# Altium schematic sheet PiAndServos.SchDoc (part 3 of 5)
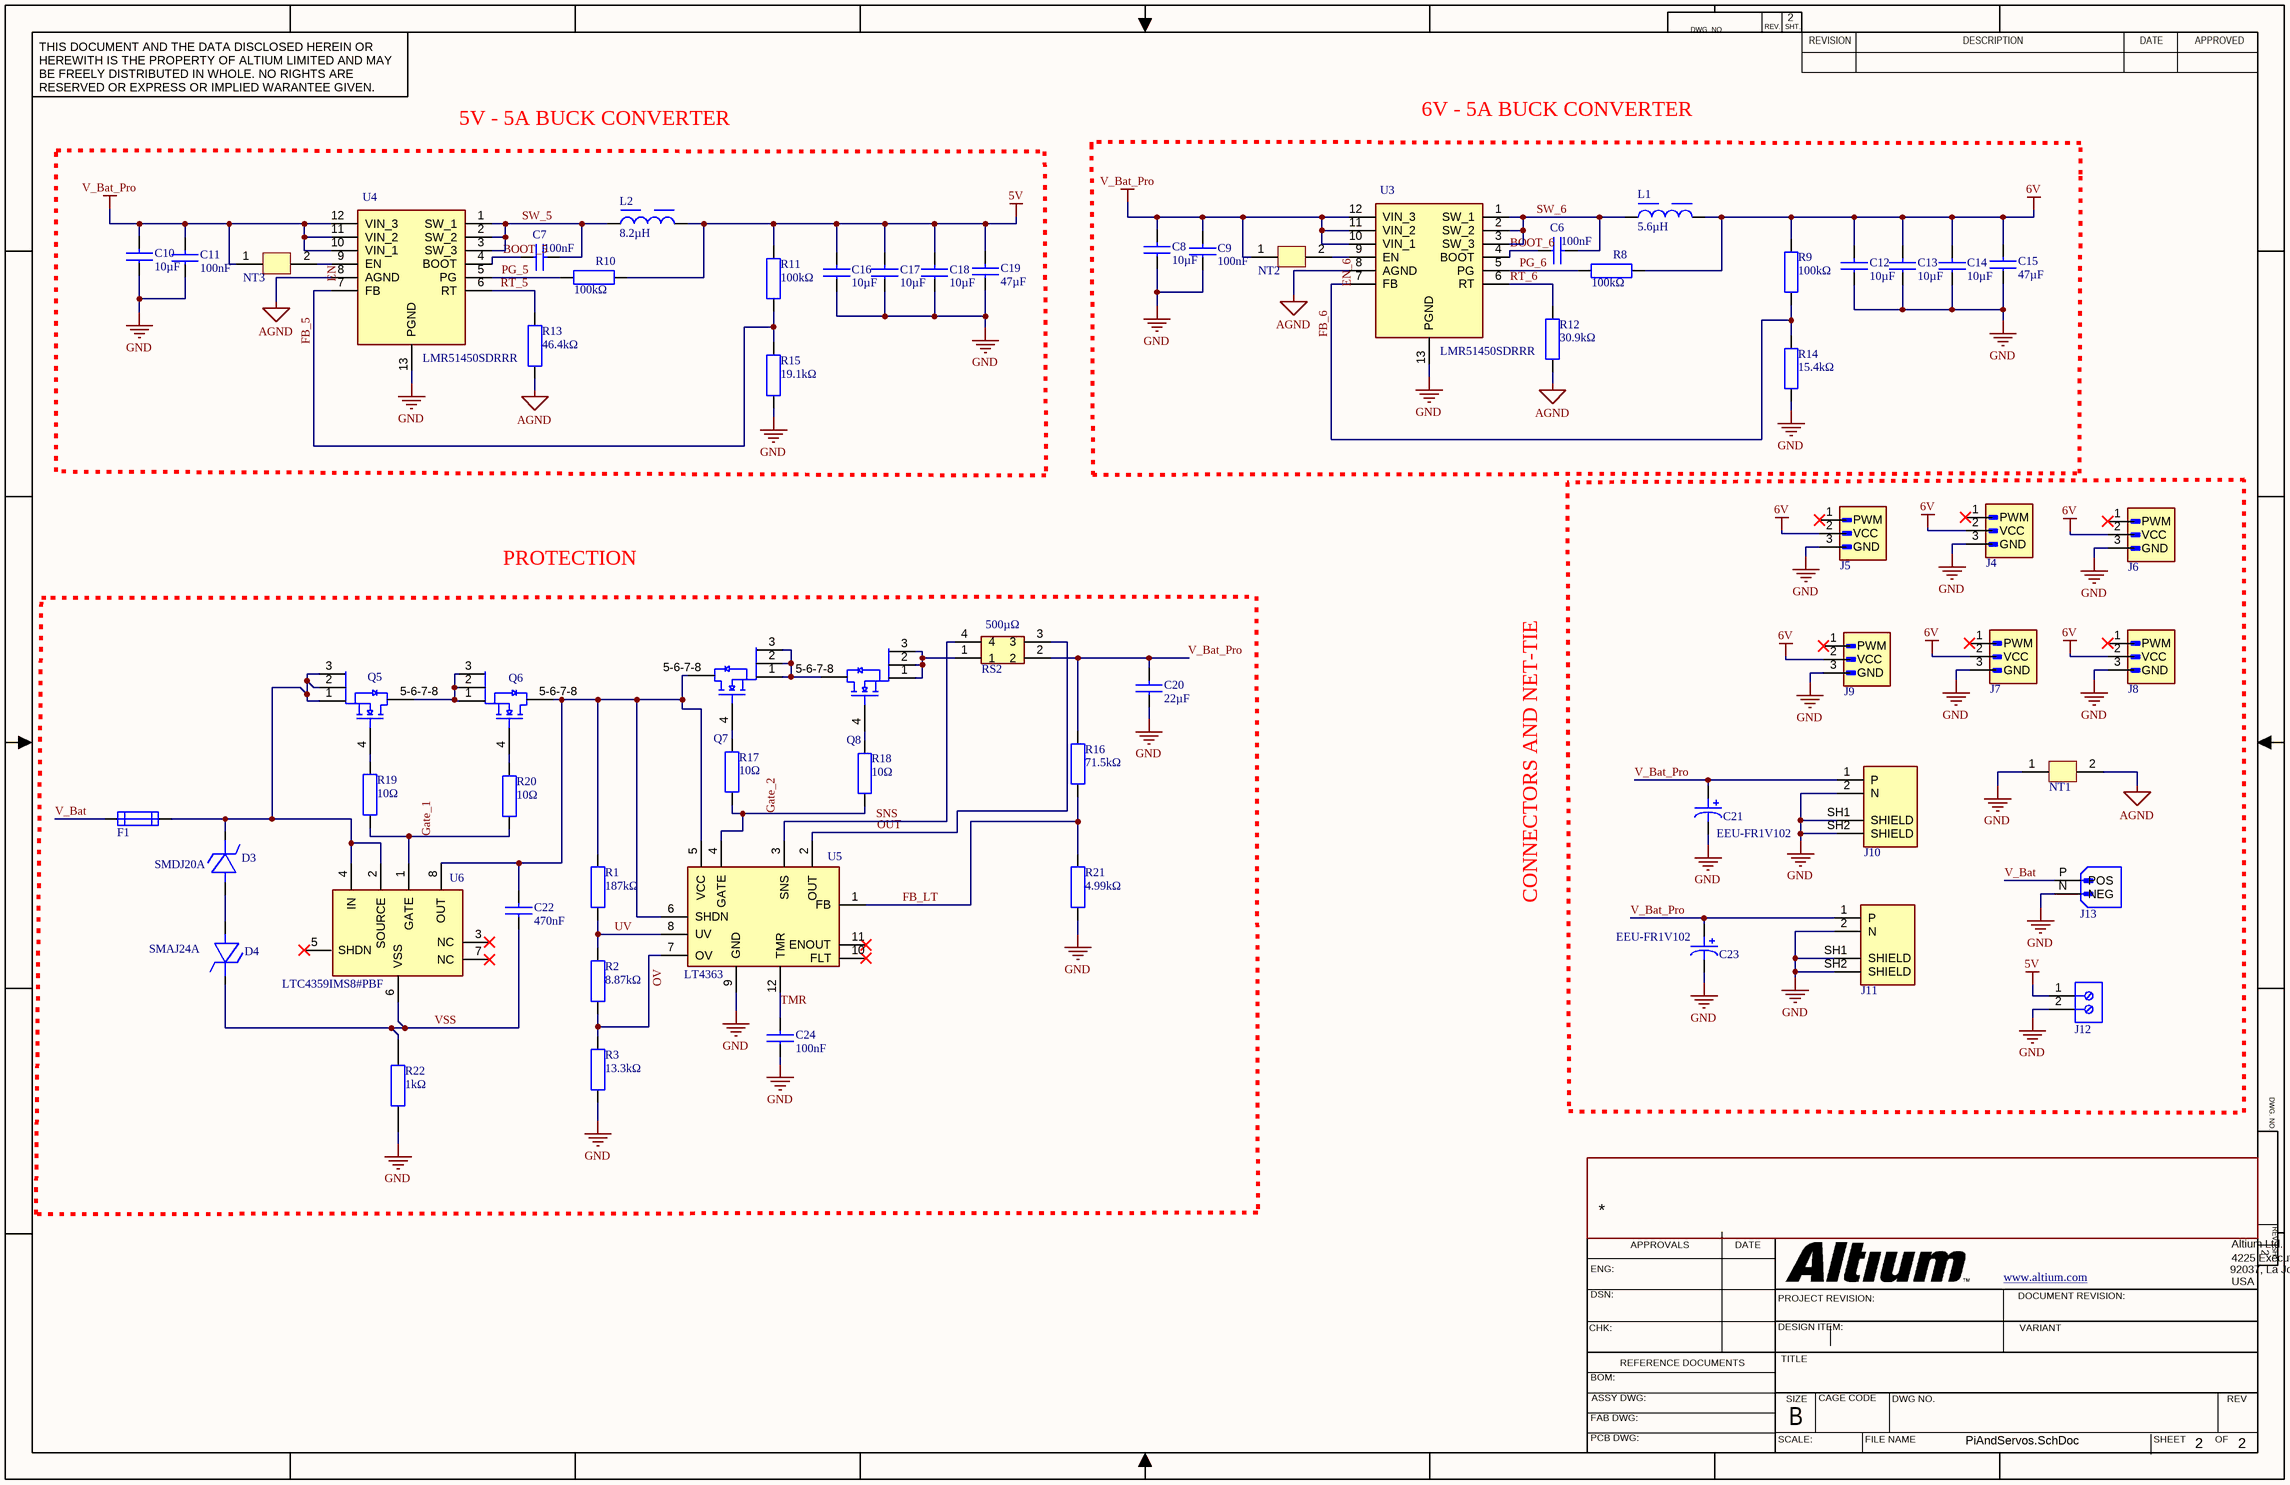
[diagram p2: PiAndServos.SchDoc]

## Library data of the parts (continued)
J12 = 1725656: Block, Terminal; 6 A; 63 V; 2.54 mm; 26 to 20 AWG; 2; Screw; Soldering; 1.5 kV; Manufacturer: Phoenix Contact; Approvals: CSA, UL, VDE, cUL; Connector Type: PCB, Screw, Terminal Block; Current: 6A; Max Supply Voltage: 63V; Number of Circuits: 2; Number of Levels: 1; Pitch: 2.54mm; Stripping Length: 4.5mm; Voltage: 125V; Voltage Rating: 160V; Wire/Cable Gauge: 20AWG; Wire Gauge (Max): 26AWG; Supplier: Arrow Electronics; Supplier Part Number: 1725656; Manufacturer Part Number: 1725656; RoHS: Compliant; Category: Terminal Blocks; Stock: 13040; Pricing: 1=1,249, 251=1,214 (USD); China RoHS: Compliant; Color: Green; Contact Material: Tin; Current Rating: 6A; Depth: 6.2mm; Flammability Rating: UL94 V-0; Height: 6.2mm; Housing Color: Green; Insulation Material: Nylon; Lead Free: Lead Free; Lead Pitch: 2.54mm; Lifecycle Status: Production; Max Current Rating: 6A; Mounting Technology: Screw; Number of Contacts: 2; Pins: 2; Number of Poles: 2; Number of Positions: 2; Number of Positions Per Level: 2; Number of Rows: 1; Radiation Hardening: No; REACH SVHC: Yes; Termination: Solder; Voltage Rating (AC): 63V; Weight: 639.990485mg; Width: 12mm; Wire Gauge (Min): 20AWG; ComponentLink1URL: https://datasheet.octopart.com:443/1725656-Phoenix-Contact-datasheet-141439143.pdf?src-supplier=Upverter; ComponentLink1Description: https://datasheet.octopart.com:443/1725656-Phoenix-Contact-datasheet-141439143.pdf?src-supplier=Upverter; ComponentLink2URL: https://datasheet.octopart.com:443/1725656-Phoenix-Contact-datasheet-101586919.pdf?src-supplier=element14+APAC; ComponentLink2Description: https://datasheet.octopart.com:443/1725656-Phoenix-Contact-datasheet-101586919.pdf?src-supplier=element14+APAC; ComponentLink3URL: https://datasheet.octopart.com:443/1725656-Phoenix-Contact-datasheet-5302866.pdf?src-supplier=element14+APAC; ComponentLink3Description: https://datasheet.octopart.com:443/1725656-Phoenix-Contact-datasheet-5302866.pdf?src-supplier=element14+APAC; ComponentLink4URL: https://datasheet.octopart.com:443/1725656-Phoenix-Contact-datasheet-66629008.pdf?src-supplier=element14+APAC; ComponentLink4Description: https://datasheet.octopart.com:443/1725656-Phoenix-Contact-datasheet-66629008.pdf?src-supplier=element14+APAC; ComponentLink5URL: https://datasheet.octopart.com:443/1725656-Phoenix-Contact-datasheet-170281659.pdf?src-supplier=Master+Electronics; ComponentLink5Description: https://datasheet.octopart.com:443/1725656-Phoenix-Contact-datasheet-170281659.pdf?src-supplier=Master+Electronics; ComponentLink6URL: https://datasheet.octopart.com:443/1725656-Phoenix-Contact-datasheet-154778688.pdf?src-supplier=Electro+Sonic; ComponentLink6Description: https://datasheet.octopart.com:443/1725656-Phoenix-Contact-datasheet-154778688.pdf?src-supplier=Electro+Sonic; ComponentLink7URL: https://datasheet.octopart.com:443/1725656-Phoenix-Contact-datasheet-525036.pdf?src-supplier=Newark; ComponentLink7Description: https://datasheet.octopart.com:443/1725656-Phoenix-Contact-datasheet-525036.pdf?src-supplier=Newark; ComponentLink8URL: https://datasheet.octopart.com:443/1725656-Phoenix-Contact-datasheet-169855803.pdf?src-supplier=Amar+Radio+Corporation; ComponentLink8Description: https://datasheet.octopart.com:443/1725656-Phoenix-Contact-datasheet-169855803.pdf?src-supplier=Amar+Radio+Corporation; ComponentLink9URL: https://datasheet.octopart.com:443/1725656-Phoenix-Contact-datasheet-164874127.pdf?src-supplier=Burklin+Elektronik; ComponentLink9Description: https://datasheet.octopart.com:443/1725656-Phoenix-Contact-datasheet-164874127.pdf?src-supplier=Burklin+Elektronik; ComponentLink10URL: https://datasheet.octopart.com:443/1725656-Phoenix-Contact-datasheet-62053918.pdf?src-supplier=TME; ComponentLink10Description: https://datasheet.octopart.com:443/1725656-Phoenix-Contact-datasheet-62053918.pdf?src-supplier=TME; ComponentLink11URL: https://datasheet.octopart.com:443/1725656-Phoenix-Contact-datasheet-11891466.pdf?src-supplier=Arrow+Electronics; ComponentLink11Description: https://datasheet.octopart.com:443/1725656-Phoenix-Contact-datasheet-11891466.pdf?src-supplier=Arrow+Electronics; ComponentLink12URL: https://datasheet.octopart.com:443/1725656-Phoenix-Contact-datasheet-33456951.pdf?src-supplier=MRO+Stop; ComponentLink12Description: https://datasheet.octopart.com:443/1725656-Phoenix-Contact-datasheet-33456951.pdf?src-supplier=MRO+Stop; ComponentLink13URL: https://datasheet.octopart.com:443/1725656-Phoenix-Contact-datasheet-62122436.pdf?src-supplier=RS+(Formerly+Allied+Electronics); ComponentLink13Description: https://datasheet.octopart.com:443/1725656-Phoenix-Contact-datasheet-62122436.pdf?src-supplier=RS+(Formerly+Allied+Electronics); ComponentLink14URL: https://datasheet.octopart.com:443/1725656-Phoenix-Contact-datasheet-9781713.pdf?src-supplier=RS+(Formerly+Allied+Electronics); ComponentLink14Description: https://datasheet.octopart.com:443/1725656-Phoenix-Contact-datasheet-9781713.pdf?src-supplier=RS+(Formerly+Allied+Electronics); ComponentLink15URL: https://datasheet.octopart.com:443/1725656-Phoenix-Contact-datasheet-84491.pdf?src-supplier=RS+(Formerly+Allied+Electronics); ComponentLink15Description: https://datasheet.octopart.com:443/1725656-Phoenix-Contact-datasheet-84491.pdf?src-supplier=RS+(Formerly+Allied+Electronics); ComponentLink16URL: https://datasheet.octopart.com:443/1725656-Phoenix-Contact-datasheet-657280.pdf?src-supplier=Farnell; ComponentLink16Description: https://datasheet.octopart.com:443/1725656-Phoenix-Contact-datasheet-657280.pdf?src-supplier=Farnell; ComponentLink17URL: https://datasheet.octopart.com:443/1725656-Phoenix-Contact-datasheet-97278.pdf?src-supplier=DigiKey; ComponentLink17Description: https://datasheet.octopart.com:443/1725656-Phoenix-Contact-datasheet-97278.pdf?src-supplier=DigiKey
L1 = XAL6060-562MEB: General Purpose Inductor, 5.6uH, 20%, 1 Element, Composite-Core, SMD, 2625; Manufacturer: Coilcraft; DC Resistance (DCR): 15.9mΩ; Max Current Rating: 10A; Number of Circuits: 1; Self Resonant Frequency: 20MHz; Shielding: Shielded; Test Frequency: 1MHz; Supplier: Arrow Electronics; Supplier Part Number: XAL6060-562MEB; Manufacturer Part Number: XAL6060-562MEB; RoHS: Compliant; Category: Fixed Inductors; Pricing: 250=4,062, 500=4,022, 1000=3,982, 2000=3,942, 2500=3,902, 3000=3,766, 4000=3,723, 5000=3,686, 10000=3,649 (USD); Core Material: Composite; Height: 6.1mm; Lead Free: Contains Lead; Length: 6.56mm; Lifecycle Status: Obsolete; Max DC Current: 10A; Max Operating Temperature: 125°C; Min Operating Temperature: -40°C; Number of Terminals: 2; Ratings: AEC-Q200; REACH SVHC: Yes; Termination: SMD/SMT; Tolerance: 20%; Width: 6.36mm; ComponentLink1URL: https://datasheet.octopart.com:443/XAL6060-562MEB-Coilcraft-datasheet-180122048.pdf?src-supplier=IHS; ComponentLink1Description: https://datasheet.octopart.com:443/XAL6060-562MEB-Coilcraft-datasheet-180122048.pdf?src-supplier=IHS; ComponentLink2URL: https://datasheet.octopart.com:443/XAL6060-562MEB-Coilcraft-datasheet-10791337.pdf?src-supplier=Coilcraft+Direct; ComponentLink2Description: https://datasheet.octopart.com:443/XAL6060-562MEB-Coilcraft-datasheet-10791337.pdf?src-supplier=Coilcraft+Direct
L2 = XAL6060-822MEB: Manufacturer: Coilcraft; Core Material: Composite; DC Resistance (DCR): 26.4mΩ; Max Current Rating: 8A; Number of Circuits: 1; Self Resonant Frequency: 16MHz; Shielding: Shielded; Test Frequency: 1MHz; Tolerance: 20%; Category: Fixed Inductors; Country of Origin: Indonesia, Mainland China, Vietnam; Export Control Classification Number (ECCN) Code: EAR99; Harmonized Tariff Schedule (HTS) Code: 8504.50.80.00; Height: 6.1mm; Introduction Date: 2011-03-29; Lead Free: Contains Lead; Length: 6.56mm; Lifecycle Status: Obsolete; LTB Date: 2021-03-01; LTD Date: 2021-03-01; Manufacturer Part Number: XAL6060-822MEB; Max DC Current: 8A; Max Operating Temperature: 125°C; Min Operating Temperature: -40°C; Number of Terminals: 2; Ratings: AEC-Q200; REACH SVHC: Yes; RoHS: Compliant; Termination: SMD/SMT; Width: 6.36mm
Q5-Q8 = BSC010N04LSI: Transistor: N-MOSFET; unipolar; 40V; 100A; 139W; PG-TDSON-8; Manufacturer: Infineon; Manufacturer Part Number: BSC010N04LSIATMA1; Continuous Drain Current (ID): 37A; Drain to Source Resistance: 1.4mΩ; Fall Time: 17ns; Gate to Source Voltage (Vgs): 20V; Input Capacitance: 6.2nF; Max Junction Temperature (Tj): 150°C; Number of Channels: 1; On-State Resistance: 1.05mΩ; Power Dissipation: 2.5W; Rise Time: 48ns; Turn-Off Delay Time: 33ns; Turn-On Delay Time: 9ns; Supplier: Farnell; Supplier Part Number: BSC010N04LSIATMA1; RoHS: Compliant; Category: MOSFETs; Stock: 10731; Pricing: 5=3,14, 50=2,04, 250=1,46, 1000=1,02, 3000=1 (EUR); China RoHS: Non-Compliant; Country of Origin: Germany, Mainland China; Drain to Source Breakdown Voltage: 40V; Drain to Source Voltage (Vdss): 40V; Export Control Classification Number (ECCN) Code: EAR99; Halogen Free: Halogen Free; Height: 1.1mm; Introduction Date: 2012-02-06; Lead Free: Contains Lead; Lifecycle Status: Production; Max Dual Supply Voltage: 40V; Max Operating Temperature: 150°C; Max Power Dissipation: 139W; Min Breakdown Voltage: 40V; Min Operating Temperature: -55°C; Mounting Technology: Surface Mount; Number of Elements: 1; Pins: 8; Number of Terminals: 8; Package Quantity: 5000; Packaging: Tape & Reel; Rds On Max: 1.05mΩ; REACH SVHC: No; Schedule B: 8541290080, 8541290080|8541290080|8541290080|8541290080|8541290080|8541290080|8541290080|8541290080|8541290080|8541290080|8541290080|8541290080|8541290080|8541290080|8541290080|8541290080|8541290080|8541290080|8541290080|8541290080|8541290080|8541290080|8541290080|85; ComponentLink1URL: https://datasheet.octopart.com:443/BSC010N04LSIATMA1-Infineon-datasheet-82520598.pdf?src-supplier=ODG+(Origin+Data+Global); ComponentLink1Description: https://datasheet.octopart.com:443/BSC010N04LSIATMA1-Infineon-datasheet-82520598.pdf?src-supplier=ODG+(Origin+Data+Global); ComponentLink2URL: https://datasheet.octopart.com:443/BSC010N04LSIATMA1-Infineon-datasheet-62293607.pdf?src-supplier=TME; ComponentLink2Description: https://datasheet.octopart.com:443/BSC010N04LSIATMA1-Infineon-datasheet-62293607.pdf?src-supplier=TME; ComponentLink3URL: http://sigma.octopart.com:80/conflict_mineral_statement/Infineon-company-51.pdf?src-supplier=Compliance+Statements; ComponentLink3Description: http://sigma.octopart.com:80/conflict_mineral_statement/Infineon-company-51.pdf?src-supplier=Compliance+Statements
R1 = RC0805FR-07187KL: Res Thick Film 0805 187K Ohm 1% 0.125W(1/8W) ±100ppm/C Pad SMD T/R; Manufacturer: Yageo Group; Manufacturer Package Identifier: 0805 (2012 metric); Max Power Dissipation: 125mW; Temperature Coefficient: 100ppm/°C; Voltage Rating: 150V; Supplier: Farnell; Supplier Part Number: RC0805FR-07187KL.; Manufacturer Part Number: RC0805FR-07187KL; RoHS: Compliant; Category: Chip SMD Resistors; Stock: 1946; Pricing: 1=0,0999, 25=0,0088, 100=0,0077 (EUR); Case/Package: 0805; Case Code (Imperial): 0805; China RoHS: Non-Compliant; Composition: Thick Film; Contact Plating: Lead, Tin; Country of Origin: Mainland China, Taiwan; Export Control Classification Number (ECCN) Code: EAR99; Features: Moisture Resistant; Height: 500µm; Harmonized Tariff Schedule (HTS) Code: 8533.21.00.30; Introduction Date: 2004-09-22; Lead Free: Lead Free; Length: 2mm; Lifecycle Status: Production; Max Operating Temperature: 155°C; Min Operating Temperature: -55°C; Mounting Technology: Surface Mount; Number of Terminals: 2; Number of Terminations: 2; Power Rating: 125mW; Radiation Hardening: No; REACH SVHC: Yes; Schedule B: 8533210045, 8533210045|8533210045|8533210045|8533210045|8533210045; Termination: SMD/SMT; Tolerance: 1%; Width: 1.25mm; Working Voltage: 150V; ComponentLink1URL: https://datasheet.octopart.com:443/RC0805FR-07187KL-Yageo-datasheet-175887523.pdf?src-supplier=IHS; ComponentLink1Description: https://datasheet.octopart.com:443/RC0805FR-07187KL-Yageo-datasheet-175887523.pdf?src-supplier=IHS; ComponentLink2URL: https://datasheet.octopart.com:443/RC0805FR-07187KL-Yageo-datasheet-103092701.pdf?src-supplier=Upverter; ComponentLink2Description: https://datasheet.octopart.com:443/RC0805FR-07187KL-Yageo-datasheet-103092701.pdf?src-supplier=Upverter; ComponentLink3URL: https://datasheet.octopart.com:443/RC0805FR-07187KL-Yageo-Group-datasheet-190305687.pdf?src-supplier=Future+Electronics; ComponentLink3Description: https://datasheet.octopart.com:443/RC0805FR-07187KL-Yageo-Group-datasheet-190305687.pdf?src-supplier=Future+Electronics; ComponentLink4URL: https://datasheet.octopart.com:443/RC0805FR-07187KL-Yageo-datasheet-12592811.pdf?src-supplier=Future+Electronics; ComponentLink4Description: https://datasheet.octopart.com:443/RC0805FR-07187KL-Yageo-datasheet-12592811.pdf?src-supplier=Future+Electronics; ComponentLink5URL: https://datasheet.octopart.com:443/RC0805FR-07187KL-Yageo-datasheet-8330313.pdf?src-supplier=Future+Electronics; ComponentLink5Description: https://datasheet.octopart.com:443/RC0805FR-07187KL-Yageo-datasheet-8330313.pdf?src-supplier=Future+Electronics; ComponentLink6URL: https://datasheet.octopart.com:443/RC0805FR-07187KL-Yageo-datasheet-8324252.pdf?src-supplier=Future+Electronics; ComponentLink6Description: https://datasheet.octopart.com:443/RC0805FR-07187KL-Yageo-datasheet-8324252.pdf?src-supplier=Future+Electronics; ComponentLink7URL: https://datasheet.octopart.com/RC0805FR-07187KL-Yageo-datasheet-73766026.pdf; ComponentLink7Description: https://datasheet.octopart.com/RC0805FR-07187KL-Yageo-datasheet-73766026.pdf; ComponentLink8URL: https://datasheet.octopart.com:443/RC0805FR-07187KL-Yageo-datasheet-118657.pdf?src-supplier=DigiKey; ComponentLink8Description: https://datasheet.octopart.com:443/RC0805FR-07187KL-Yageo-datasheet-118657.pdf?src-supplier=DigiKey; ComponentLink9URL: http://sigma.octopart.com:80/conflict_mineral_statement/Yageo-company-3.pdf?src-supplier=Compliance+Statements; ComponentLink9Description: http://sigma.octopart.com:80/conflict_mineral_statement/Yageo-company-3.pdf?src-supplier=Compliance+Statements; ComponentLink10URL: http://sigma.octopart.com:80/rohs_statement/Yageo-company-2.pdf?src-supplier=Compliance+Statements; ComponentLink10Description: http://sigma.octopart.com:80/rohs_statement/Yageo-company-2.pdf?src-supplier=Compliance+Statements
R2 = RC0805FR-078K87L: Res Thick Film 0805 8.87K Ohm 1% 0.125W(1/8W) ±100ppm/C Pad SMD T/R; Manufacturer: Yageo Group; Manufacturer Package Identifier: 0805 (2012 metric); Max Power Dissipation: 125mW; Temperature Coefficient: 100ppm/°C; Voltage Rating: 150V; Supplier: Farnell; Supplier Part Number: RC0805FR-078K87L; Manufacturer Part Number: RC0805FR-078K87L; RoHS: Compliant; Category: Chip SMD Resistors; Stock: 10000; Pricing: 5000=0,004 (EUR); Case/Package: 0805; Case Code (Imperial): 0805; China RoHS: Non-Compliant; Composition: Thick Film; Contact Plating: Lead, Tin; Depth: 1.25mm; Features: Moisture Resistant; Height: 500µm; Lead Free: Lead Free; Length: 2mm; Lifecycle Status: Production; Max Operating Temperature: 155°C; Military Standard: Not; Min Operating Temperature: -55°C; Mounting Technology: Surface Mount; Number of Terminals: 2; Number of Terminations: 2; Power Rating: 125mW; Radiation Hardening: No; REACH SVHC: Yes; Schedule B: 8533210045, 8533210045|8533210045|8533210045|8533210045|8533210045; Termination: SMD/SMT; Tolerance: 1%; Voltage Rating (DC): 150V; Width: 1.25mm; Working Voltage: 150V; ComponentLink1URL: https://datasheet.octopart.com:443/RC0805FR-078K87L-Yageo-datasheet-175887523.pdf?src-supplier=Newark; ComponentLink1Description: https://datasheet.octopart.com:443/RC0805FR-078K87L-Yageo-datasheet-175887523.pdf?src-supplier=Newark; ComponentLink2URL: https://datasheet.octopart.com:443/RC0805FR-078K87L-Yageo-datasheet-103092701.pdf?src-supplier=Upverter; ComponentLink2Description: https://datasheet.octopart.com:443/RC0805FR-078K87L-Yageo-datasheet-103092701.pdf?src-supplier=Upverter; ComponentLink3URL: https://datasheet.octopart.com:443/RC0805FR-078K87L-Yageo-Group-datasheet-176638170.pdf?src-supplier=Future+Electronics; ComponentLink3Description: https://datasheet.octopart.com:443/RC0805FR-078K87L-Yageo-Group-datasheet-176638170.pdf?src-supplier=Future+Electronics; ComponentLink4URL: https://datasheet.octopart.com:443/RC0805FR-078K87L-Yageo-datasheet-164759695.pdf?src-supplier=Future+Electronics; ComponentLink4Description: https://datasheet.octopart.com:443/RC0805FR-078K87L-Yageo-datasheet-164759695.pdf?src-supplier=Future+Electronics; ComponentLink5URL: https://datasheet.octopart.com:443/RC0805FR-078K87L-Yageo-datasheet-12592811.pdf?src-supplier=Future+Electronics; ComponentLink5Description: https://datasheet.octopart.com:443/RC0805FR-078K87L-Yageo-datasheet-12592811.pdf?src-supplier=Future+Electronics; ComponentLink6URL: https://datasheet.octopart.com:443/RC0805FR-078K87L-Yageo-datasheet-8330313.pdf?src-supplier=Future+Electronics; ComponentLink6Description: https://datasheet.octopart.com:443/RC0805FR-078K87L-Yageo-datasheet-8330313.pdf?src-supplier=Future+Electronics; ComponentLink7URL: https://datasheet.octopart.com:443/RC0805FR-078K87L-Yageo-datasheet-8324252.pdf?src-supplier=Future+Electronics; ComponentLink7Description: https://datasheet.octopart.com:443/RC0805FR-078K87L-Yageo-datasheet-8324252.pdf?src-supplier=Future+Electronics; ComponentLink8URL: https://datasheet.octopart.com/RC0805FR-078K87L-Yageo-datasheet-73766026.pdf; ComponentLink8Description: https://datasheet.octopart.com/RC0805FR-078K87L-Yageo-datasheet-73766026.pdf; ComponentLink9URL: https://datasheet.octopart.com:443/RC0805FR-078K87L-Yageo-datasheet-118657.pdf?src-supplier=DigiKey; ComponentLink9Description: https://datasheet.octopart.com:443/RC0805FR-078K87L-Yageo-datasheet-118657.pdf?src-supplier=DigiKey; ComponentLink10URL: http://sigma.octopart.com:80/conflict_mineral_statement/Yageo-company-3.pdf?src-supplier=Compliance+Statements; ComponentLink10Description: http://sigma.octopart.com:80/conflict_mineral_statement/Yageo-company-3.pdf?src-supplier=Compliance+Statements; ComponentLink11URL: http://sigma.octopart.com:80/rohs_statement/Yageo-company-2.pdf?src-supplier=Compliance+Statements; ComponentLink11Description: http://sigma.octopart.com:80/rohs_statement/Yageo-company-2.pdf?src-supplier=Compliance+Statements
R3 = RC0805FR-0713K3L: Res Thick Film 0805 13.3K Ohm 1% 0.125W(1/8W) ±100ppm/C Pad SMD T/R; Manufacturer: Yageo Group; Max Power Dissipation: 125mW; Temperature Coefficient: 100ppm/°C; Voltage Rating: 150V; Supplier: Farnell; Supplier Part Number: RC0805FR-0713K3L; Manufacturer Part Number: RC0805FR-0713K3L; RoHS: Compliant; Category: Chip SMD Resistors; Stock: 7949; Pricing: 10=0,0076, 100=0,0069, 500=0,0068, 1000=0,0066, 2500=0,0065 (EUR); Case/Package: 0805; Case Code (Imperial): 0805; China RoHS: Non-Compliant; Composition: Thick Film; Contact Plating: Lead, Tin; Country of Origin: Mainland China, Taiwan; Depth: 1.25mm; Export Control Classification Number (ECCN) Code: EAR99; Features: Moisture Resistant; Height: 500µm; Harmonized Tariff Schedule (HTS) Code: 8533.21.00.30; Introduction Date: 2004-09-22; Lead Free: Lead Free; Length: 2mm; Lifecycle Status: Production; Max Operating Temperature: 155°C; Military Standard: Not; Min Operating Temperature: -55°C; Mounting Technology: Surface Mount; Number of Terminals: 2; Number of Terminations: 2; Packaging: Tape & Reel; Power Rating: 125mW; Radiation Hardening: No; REACH SVHC: Yes; Schedule B: 8533210045, 8533210045|8533210045|8533210045|8533210045|8533210045; Termination: SMD/SMT; Tolerance: 1%; Width: 1.25mm; Working Voltage: 150V; ComponentLink1URL: https://datasheet.octopart.com:443/RC0805FR-0713K3L-Yageo-datasheet-175887523.pdf?src-supplier=Newark; ComponentLink1Description: https://datasheet.octopart.com:443/RC0805FR-0713K3L-Yageo-datasheet-175887523.pdf?src-supplier=Newark; ComponentLink2URL: https://datasheet.octopart.com:443/RC0805FR-0713K3L-Yageo-datasheet-103092701.pdf?src-supplier=Upverter; ComponentLink2Description: https://datasheet.octopart.com:443/RC0805FR-0713K3L-Yageo-datasheet-103092701.pdf?src-supplier=Upverter; ComponentLink3URL: https://datasheet.octopart.com:443/RC0805FR-0713K3L-Yageo-Group-datasheet-176638170.pdf?src-supplier=Future+Electronics; ComponentLink3Description: https://datasheet.octopart.com:443/RC0805FR-0713K3L-Yageo-Group-datasheet-176638170.pdf?src-supplier=Future+Electronics; ComponentLink4URL: https://datasheet.octopart.com:443/RC0805FR-0713K3L-Yageo-datasheet-164759695.pdf?src-supplier=Future+Electronics; ComponentLink4Description: https://datasheet.octopart.com:443/RC0805FR-0713K3L-Yageo-datasheet-164759695.pdf?src-supplier=Future+Electronics; ComponentLink5URL: https://datasheet.octopart.com:443/RC0805FR-0713K3L-Yageo-datasheet-12592811.pdf?src-supplier=Future+Electronics; ComponentLink5Description: https://datasheet.octopart.com:443/RC0805FR-0713K3L-Yageo-datasheet-12592811.pdf?src-supplier=Future+Electronics; ComponentLink6URL: https://datasheet.octopart.com:443/RC0805FR-0713K3L-Yageo-datasheet-8330313.pdf?src-supplier=Future+Electronics; ComponentLink6Description: https://datasheet.octopart.com:443/RC0805FR-0713K3L-Yageo-datasheet-8330313.pdf?src-supplier=Future+Electronics; ComponentLink7URL: https://datasheet.octopart.com:443/RC0805FR-0713K3L-Yageo-datasheet-8324252.pdf?src-supplier=Future+Electronics; ComponentLink7Description: https://datasheet.octopart.com:443/RC0805FR-0713K3L-Yageo-datasheet-8324252.pdf?src-supplier=Future+Electronics; ComponentLink8URL: https://datasheet.octopart.com:443/RC0805FR-0713K3L-Yageo-datasheet-148775077.pdf?src-supplier=TME; ComponentLink8Description: https://datasheet.octopart.com:443/RC0805FR-0713K3L-Yageo-datasheet-148775077.pdf?src-supplier=TME; ComponentLink9URL: https://datasheet.octopart.com/RC0805FR-0713K3L-Yageo-datasheet-73766026.pdf; ComponentLink9Description: https://datasheet.octopart.com/RC0805FR-0713K3L-Yageo-datasheet-73766026.pdf; ComponentLink10URL: https://datasheet.octopart.com:443/RC0805FR-0713K3L-Yageo-datasheet-118657.pdf?src-supplier=DigiKey; ComponentLink10Description: https://datasheet.octopart.com:443/RC0805FR-0713K3L-Yageo-datasheet-118657.pdf?src-supplier=DigiKey; ComponentLink11URL: http://sigma.octopart.com:80/conflict_mineral_statement/Yageo-company-3.pdf?src-supplier=Compliance+Statements; ComponentLink11Description: http://sigma.octopart.com:80/conflict_mineral_statement/Yageo-company-3.pdf?src-supplier=Compliance+Statements; ComponentLink12URL: http://sigma.octopart.com:80/rohs_statement/Yageo-company-2.pdf?src-supplier=Compliance+Statements; ComponentLink12Description: http://sigma.octopart.com:80/rohs_statement/Yageo-company-2.pdf?src-supplier=Compliance+Statements
R8 R10 = CRCW0603100KFKEA: 100mW Thick Film Resistors 75V ±100ppm/℃ ±1% 100kΩ 0603 Chip Resistor - Surface Mount ROHS; Manufacturer: Vishay; Manufacturer Part Number: CRCW0603100KFKEAC; Temperature Coefficient: 100ppm/°C; Supplier: Farnell; Supplier Part Number: CRCW0603100KFKEAC; RoHS: Compliant; Category: Chip SMD Resistors; Stock: 17196; Pricing: 10=0,0138, 100=0,0112, 500=0,0078, 1000=0,0069, 2500=0,0062, 5000=0,0055 (EUR); Case/Package: 0603; China RoHS: Non-Compliant; Composition: Thick Film; Contact Plating: Tin; Country of Origin: Mainland China; Export Control Classification Number (ECCN) Code: EAR99; Height: 450µm; Harmonized Tariff Schedule (HTS) Code: 8533.21.00.30; Introduction Date: 2013-06-05; Lead Free: Lead Free; Length: 1.6mm; Lifecycle Status: Production; Max Operating Temperature: 155°C; Min Operating Temperature: -55°C; Mounting Technology: Surface Mount; Number of Terminals: 2; Power Rating: 100mW; REACH SVHC: Yes; Schedule B: 8533210045, 8533210045|8533210045, 8533210045|8533210045|8533210045, 8533210045|8533210045|8533210045|8533210045; Termination: Wraparound; Tolerance: 1%; Voltage Rating: 75V; Width: 800µm; Working Voltage: 75V; ComponentLink1URL: https://datasheet.octopart.com:443/CRCW0603100KFKEAC-Vishay-datasheet-102570912.pdf?src-supplier=Upverter; ComponentLink1Description: https://datasheet.octopart.com:443/CRCW0603100KFKEAC-Vishay-datasheet-102570912.pdf?src-supplier=Upverter; ComponentLink2URL: https://datasheet.octopart.com:443/CRCW0603100KFKEAC-Vishay-datasheet-175423585.pdf?src-supplier=IHS; ComponentLink2Description: https://datasheet.octopart.com:443/CRCW0603100KFKEAC-Vishay-datasheet-175423585.pdf?src-supplier=IHS; ComponentLink3URL: https://datasheet.octopart.com:443/CRCW0603100KFKEAC-Vishay-datasheet-100063072.pdf?src-supplier=Future+Electronics; ComponentLink3Description: https://datasheet.octopart.com:443/CRCW0603100KFKEAC-Vishay-datasheet-100063072.pdf?src-supplier=Future+Electronics; ComponentLink4URL: https://datasheet.octopart.com:443/CRCW0603100KFKEAC-Vishay-datasheet-62316122.pdf?src-supplier=Future+Electronics; ComponentLink4Description: https://datasheet.octopart.com:443/CRCW0603100KFKEAC-Vishay-datasheet-62316122.pdf?src-supplier=Future+Electronics; ComponentLink5URL: http://sigma.octopart.com:80/rohs_statement/Vishay-company-15.pdf?src-supplier=Compliance+Statements; ComponentLink5Description: http://sigma.octopart.com:80/rohs_statement/Vishay-company-15.pdf?src-supplier=Compliance+Statements
R9 R11 = CRCW0402100KFKED: 63mW Thick Film Resistors 75V ±1% ±100ppm/℃ 100kΩ 0402 Chip Resistor - Surface Mount ROHS; Manufacturer: Vishay; Temperature Coefficient: 100ppm/°C; Voltage Rating: 50V; Supplier: Farnell; Supplier Part Number: CRCW0402100KFKED; Manufacturer Part Number: CRCW0402100KFKED; RoHS: Compliant; Category: Chip SMD Resistors; Stock: 2585342; Pricing: 10=0,0138, 100=0,0104, 500=0,0086, 2500=0,0078, 5000=0,0061, 10000=0,004 (EUR); Case/Package: 0402; Case Code (Imperial): 0402; China RoHS: Non-Compliant; Composition: Thick Film; Contact Plating: Tin; Depth: 500µm; Features: Automotive AEC-Q200; Height: 350µm; Lead Free: Lead Free; Length: 1mm; Lifecycle Status: Production; Max Operating Temperature: 155°C; Max Power Dissipation: 63mW; Military Standard: Not; Min Operating Temperature: -55°C; Mounting Technology: Surface Mount; Pins: 2; Number of Terminals: 2; Number of Terminations: 2; Packaging: Cut Tape; Power Rating: 63mW; Radiation Hardening: No; Ratings: AEC-Q200; REACH SVHC: Yes; Schedule B: 8533210045, 8533210045|8533210045|8533210045|8533210045|8533210045|8533210045|8533210045|8533210045|8533210045|8533210045|8533210045|8533210045|8533210045|8533210045|8533210045|8533210045|8533210045|8533210045|8533210045|8533210045|8533210045|8533210045|8533210045|85; Termination: SMD/SMT; Tolerance: 1%; Voltage Rating (DC): 50V; Weight: 652.039032µg; Width: 500µm; Working Voltage: 50V; ComponentLink1URL: https://datasheet.octopart.com:443/CRCW0402100KFKED-Vishay-datasheet-175423584.pdf?src-supplier=IHS; ComponentLink1Description: https://datasheet.octopart.com:443/CRCW0402100KFKED-Vishay-datasheet-175423584.pdf?src-supplier=IHS; ComponentLink2URL: https://datasheet.octopart.com:443/CRCW0402100KFKED-Vishay-datasheet-21268119.pdf?src-supplier=Upverter; ComponentLink2Description: https://datasheet.octopart.com:443/CRCW0402100KFKED-Vishay-datasheet-21268119.pdf?src-supplier=Upverter; ComponentLink3URL: https://datasheet.octopart.com:443/CRCW0402100KFKED-Vishay-datasheet-83961561.pdf?src-supplier=element14+APAC; ComponentLink3Description: https://datasheet.octopart.com:443/CRCW0402100KFKED-Vishay-datasheet-83961561.pdf?src-supplier=element14+APAC; ComponentLink4URL: https://datasheet.octopart.com:443/CRCW0402100KFKED-Vishay-datasheet-62317933.pdf?src-supplier=element14+APAC; ComponentLink4Description: https://datasheet.octopart.com:443/CRCW0402100KFKED-Vishay-datasheet-62317933.pdf?src-supplier=element14+APAC; ComponentLink5URL: https://datasheet.octopart.com:443/CRCW0402100KFKED-Vishay-datasheet-14722531.pdf?src-supplier=element14+APAC; ComponentLink5Description: https://datasheet.octopart.com:443/CRCW0402100KFKED-Vishay-datasheet-14722531.pdf?src-supplier=element14+APAC; ComponentLink6URL: https://datasheet.octopart.com:443/CRCW0402100KFKED-Vishay-datasheet-66077789.pdf?src-supplier=element14+APAC; ComponentLink6Description: https://datasheet.octopart.com:443/CRCW0402100KFKED-Vishay-datasheet-66077789.pdf?src-supplier=element14+APAC; ComponentLink7URL: https://datasheet.octopart.com:443/CRCW0402100KFKED-Vishay-datasheet-16179825.pdf?src-supplier=element14+APAC; ComponentLink7Description: https://datasheet.octopart.com:443/CRCW0402100KFKED-Vishay-datasheet-16179825.pdf?src-supplier=element14+APAC; ComponentLink8URL: https://datasheet.octopart.com:443/CRCW0402100KFKED.-Vishay-datasheet-78776209.pdf?src-supplier=Newark; ComponentLink8Description: https://datasheet.octopart.com:443/CRCW0402100KFKED.-Vishay-datasheet-78776209.pdf?src-supplier=Newark; ComponentLink9URL: https://datasheet.octopart.com:443/CRCW0402100KFKED-Vishay-datasheet-11516975.pdf?src-supplier=Newark; ComponentLink9Description: https://datasheet.octopart.com:443/CRCW0402100KFKED-Vishay-datasheet-11516975.pdf?src-supplier=Newark; ComponentLink10URL: https://datasheet.octopart.com:443/CRCW0402100KFKED-Vishay-datasheet-41302739.pdf?src-supplier=Newark; ComponentLink10Description: https://datasheet.octopart.com:443/CRCW0402100KFKED-Vishay-datasheet-41302739.pdf?src-supplier=Newark; ComponentLink11URL: https://datasheet.octopart.com:443/CRCW0402100KFKED-Vishay-datasheet-27121962.pdf?src-supplier=Newark; ComponentLink11Description: https://datasheet.octopart.com:443/CRCW0402100KFKED-Vishay-datasheet-27121962.pdf?src-supplier=Newark; ComponentLink12URL: https://datasheet.octopart.com:443/CRCW0402100KFKED-Vishay-datasheet-5300368.pdf?src-supplier=Future+Electronics; ComponentLink12Description: https://datasheet.octopart.com:443/CRCW0402100KFKED-Vishay-datasheet-5300368.pdf?src-supplier=Future+Electronics; ComponentLink13URL: https://datasheet.octopart.com:443/CRCW0402100KFKED-Vishay-datasheet-62316122.pdf?src-supplier=Future+Electronics; ComponentLink13Description: https://datasheet.octopart.com:443/CRCW0402100KFKED-Vishay-datasheet-62316122.pdf?src-supplier=Future+Electronics; ComponentLink14URL: https://datasheet.octopart.com:443/CRCW0402100KFKED-Vishay-datasheet-5306405.pdf?src-supplier=RS+(Formerly+Allied+Electronics); ComponentLink14Description: https://datasheet.octopart.com:443/CRCW0402100KFKED-Vishay-datasheet-5306405.pdf?src-supplier=RS+(Formerly+Allied+Electronics); ComponentLink15URL: https://datasheet.octopart.com:443/CRCW0402100KFKED-Vishay-Dale-datasheet-47688880.pdf?src-supplier=RS+(Formerly+Allied+Electronics); ComponentLink15Description: https://datasheet.octopart.com:443/CRCW0402100KFKED-Vishay-Dale-datasheet-47688880.pdf?src-supplier=RS+(Formerly+Allied+Electronics); ComponentLink16URL: https://datasheet.octopart.com:443/CRCW0402100KFKED-Vishay-datasheet-12001583.pdf?src-supplier=RS+(Formerly+Allied+Electronics); ComponentLink16Description: https://datasheet.octopart.com:443/CRCW0402100KFKED-Vishay-datasheet-12001583.pdf?src-supplier=RS+(Formerly+Allied+Electronics); ComponentLink17URL: https://datasheet.octopart.com:443/CRCW0402100KFKED-Vishay-datasheet-192322385.pdf?src-supplier=HQonline; ComponentLink17Description: https://datasheet.octopart.com:443/CRCW0402100KFKED-Vishay-datasheet-192322385.pdf?src-supplier=HQonline; ComponentLink18URL: https://datasheet.octopart.com:443/CRCW0402100KFKED-Vishay-datasheet-62332075.pdf?src-supplier=TME; ComponentLink18Description: https://datasheet.octopart.com:443/CRCW0402100KFKED-Vishay-datasheet-62332075.pdf?src-supplier=TME; ComponentLink19URL: https://datasheet.octopart.com/D-CRCW-e3-Standard-Thick-Film-Chip-Resistors-Vishay-datasheet-family-64.pdf; ComponentLink19Description: https://datasheet.octopart.com/D-CRCW-e3-Standard-Thick-Film-Chip-Resistors-Vishay-datasheet-family-64.pdf; ComponentLink20URL: https://datasheet.octopart.com:443/CRCW0402100KFKED-Vishay-datasheet-13242068.pdf?src-supplier=Farnell; ComponentLink20Description: https://datasheet.octopart.com:443/CRCW0402100KFKED-Vishay-datasheet-13242068.pdf?src-supplier=Farnell; ComponentLink21URL: https://datasheet.octopart.com:443/CRCW0402100KFKED-Vishay-datasheet-13195083.pdf?src-supplier=Farnell; ComponentLink21Description: https://datasheet.octopart.com:443/CRCW0402100KFKED-Vishay-datasheet-13195083.pdf?src-supplier=Farnell; ComponentLink22URL: https://datasheet.octopart.com:443/CRCW0402100KFKED-Vishay-datasheet-13034211.pdf?src-supplier=Farnell; ComponentLink22Description: https://datasheet.octopart.com:443/CRCW0402100KFKED-Vishay-datasheet-13034211.pdf?src-supplier=Farnell; ComponentLink23URL: https://datasheet.octopart.com:443/CRCW0402100KFKED-Vishay-datasheet-12600034.pdf?src-supplier=Farnell; ComponentLink23Description: https://datasheet.octopart.com:443/CRCW0402100KFKED-Vishay-datasheet-12600034.pdf?src-supplier=Farnell; ComponentLink24URL: https://datasheet.octopart.com:443/CRCW0402100KFKED-Vishay-datasheet-12532161.pdf?src-supplier=Farnell; ComponentLink24Description: https://datasheet.octopart.com:443/CRCW0402100KFKED-Vishay-datasheet-12532161.pdf?src-supplier=Farnell; ComponentLink25URL: https://datasheet.octopart.com:443/CRCW0402100KFKED-Vishay-datasheet-12517896.pdf?src-supplier=Farnell; ComponentLink25Description: https://datasheet.octopart.com:443/CRCW0402100KFKED-Vishay-datasheet-12517896.pdf?src-supplier=Farnell; ComponentLink26URL: https://datasheet.octopart.com:443/CRCW0402100KFKED-Vishay-datasheet-12509762.pdf?src-supplier=Farnell; ComponentLink26Description: https://datasheet.octopart.com:443/CRCW0402100KFKED-Vishay-datasheet-12509762.pdf?src-supplier=Farnell; ComponentLink27URL: https://datasheet.octopart.com:443/CRCW0402100KFKED-Vishay-datasheet-10322335.pdf?src-supplier=Farnell; ComponentLink27Description: https://datasheet.octopart.com:443/CRCW0402100KFKED-Vishay-datasheet-10322335.pdf?src-supplier=Farnell; ComponentLink28URL: https://datasheet.octopart.com:443/CRCW0402100KFKED-Vishay-datasheet-8788789.pdf?src-supplier=Farnell; ComponentLink28Description: https://datasheet.octopart.com:443/CRCW0402100KFKED-Vishay-datasheet-8788789.pdf?src-supplier=Farnell; ComponentLink29URL: https://datasheet.octopart.com:443/CRCW0402100KFKED-Vishay-datasheet-8361388.pdf?src-supplier=Farnell; ComponentLink29Description: https://datasheet.octopart.com:443/CRCW0402100KFKED-Vishay-datasheet-8361388.pdf?src-supplier=Farnell; ComponentLink30URL: https://datasheet.octopart.com:443/CRCW0402100KFKED-Vishay-datasheet-546287.pdf?src-supplier=Farnell; ComponentLink30Description: https://datasheet.octopart.com:443/CRCW0402100KFKED-Vishay-datasheet-546287.pdf?src-supplier=Farnell; ComponentLink31URL: https://datasheet.octopart.com:443/CRCW0402100KFKED-Vishay-datasheet-11540273.pdf?src-supplier=Arrow+Electronics; ComponentLink31Description: https://datasheet.octopart.com:443/CRCW0402100KFKED-Vishay-datasheet-11540273.pdf?src-supplier=Arrow+Electronics; ComponentLink32URL: https://datasheet.octopart.com:443/CRCW0402100KFKED-Vishay-datasheet-8619608.pdf?src-supplier=element14; ComponentLink32Description: https://datasheet.octopart.com:443/CRCW0402100KFKED-Vishay-datasheet-8619608.pdf?src-supplier=element14; ComponentLink33URL: https://datasheet.octopart.com:443/CRCW0402100KFKED-Vishay-datasheet-5377255.pdf?src-supplier=Garrett; ComponentLink33Description: https://datasheet.octopart.com:443/CRCW0402100KFKED-Vishay-datasheet-5377255.pdf?src-supplier=Garrett; ComponentLink34URL: https://datasheet.octopart.com:443/CRCW0402100KFKED-Vishay-datasheet-148188.pdf?src-supplier=Garrett; ComponentLink34Description: https://datasheet.octopart.com:443/CRCW0402100KFKED-Vishay-datasheet-148188.pdf?src-supplier=Garrett; ComponentLink35URL: https://datasheet.octopart.com:443/CRCW0402100KFKED-Vishay-datasheet-42367.pdf?src-supplier=Garrett; ComponentLink35Description: https://datasheet.octopart.com:443/CRCW0402100KFKED-Vishay-datasheet-42367.pdf?src-supplier=Garrett; ComponentLink36URL: http://sigma.octopart.com:80/rohs_certificate/D-CRCW-e3-Standard-Thick-Film-Chip-Resistors-Vishay-family-102.pdf?src-supplier=Compliance+Statements; ComponentLink36Description: http://sigma.octopart.com:80/rohs_certificate/D-CRCW-e3-Standard-Thick-Film-Chip-Resistors-Vishay-family-102.pdf?src-supplier=Compliance+Statements
R12 = CRCW040230K9FKED: Fixed Resistor, Metal Glaze/Thick Film, 0.063W, 30900ohm, 50V, 1% +/-Tol, Surface Mount, 0402; Manufacturer: Vishay; Max Power Dissipation: 63mW; Temperature Coefficient: 100ppm/°C; Supplier: Farnell; Supplier Part Number: CRCW040230K9FKED; Manufacturer Part Number: CRCW040230K9FKED; RoHS: Compliant; Category: Chip SMD Resistors; Stock: 21103; Pricing: 10=0,0195, 100=0,0141, 500=0,0114, 2500=0,0094, 5000=0,0091, 10000=0,0088 (EUR); Case/Package: 0402; Case Code (Imperial): 0402; China RoHS: Non-Compliant; Composition: Thick Film; Contact Plating: Tin; Country of Origin: Israel, Taiwan; Depth: 500µm; Export Control Classification Number (ECCN) Code: EAR99; Features: Automotive AEC-Q200; Height: 350µm; Harmonized Tariff Schedule (HTS) Code: 8533.21.00.30; Introduction Date: 2005-03-24; Lead Free: Lead Free; Length: 1mm; Lifecycle Status: Production; Max Operating Temperature: 155°C; Military Standard: Not; Min Operating Temperature: -55°C; Mounting Technology: Surface Mount; Pins: 2; Number of Terminals: 2; Number of Terminations: 2; Packaging: Cut Tape; Power Rating: 63mW; Radiation Hardening: No; Ratings: AEC-Q200; REACH SVHC: Yes; Schedule B: 8533210045, 8533210045|8533210045|8533210045|8533210045|8533210045|8533210045|8533210045|8533210045|8533210045, 8533210045|8533210045|8533210045|8533210045|8533210045|8533210045|8533210045|8533210045|8533210045|8533210045, 8533210045|8533210045|8533210045|8533210045|8533210045|8533210045|8533210045|8533210045|8533210045|8533210045|8533210045; Termination: SMD/SMT; Tolerance: 1%; Voltage Rating: 50V; Voltage Rating (DC): 50V; Weight: 652.039032µg; Width: 500µm; Working Voltage: 50V; ComponentLink1URL: https://datasheet.octopart.com:443/CRCW040230K9FKED-Vishay-datasheet-175423584.pdf?src-supplier=IHS; ComponentLink1Description: https://datasheet.octopart.com:443/CRCW040230K9FKED-Vishay-datasheet-175423584.pdf?src-supplier=IHS; ComponentLink2URL: https://datasheet.octopart.com:443/CRCW040230K9FKED-Vishay-datasheet-83961561.pdf?src-supplier=element14+APAC; ComponentLink2Description: https://datasheet.octopart.com:443/CRCW040230K9FKED-Vishay-datasheet-83961561.pdf?src-supplier=element14+APAC; ComponentLink3URL: https://datasheet.octopart.com:443/CRCW040230K9FKED-Vishay-datasheet-62317933.pdf?src-supplier=element14+APAC; ComponentLink3Description: https://datasheet.octopart.com:443/CRCW040230K9FKED-Vishay-datasheet-62317933.pdf?src-supplier=element14+APAC; ComponentLink4URL: https://datasheet.octopart.com:443/CRCW040230K9FKED-Vishay-datasheet-14722531.pdf?src-supplier=element14+APAC; ComponentLink4Description: https://datasheet.octopart.com:443/CRCW040230K9FKED-Vishay-datasheet-14722531.pdf?src-supplier=element14+APAC; ComponentLink5URL: https://datasheet.octopart.com:443/CRCW040230K9FKED-Vishay-datasheet-5299586.pdf?src-supplier=element14+APAC; ComponentLink5Description: https://datasheet.octopart.com:443/CRCW040230K9FKED-Vishay-datasheet-5299586.pdf?src-supplier=element14+APAC; ComponentLink6URL: https://datasheet.octopart.com:443/CRCW040230K9FKED-Vishay-datasheet-10380026.pdf?src-supplier=element14+APAC; ComponentLink6Description: https://datasheet.octopart.com:443/CRCW040230K9FKED-Vishay-datasheet-10380026.pdf?src-supplier=element14+APAC; ComponentLink7URL: https://datasheet.octopart.com:443/CRCW040230K9FKED.-Vishay-datasheet-78776209.pdf?src-supplier=Newark; ComponentLink7Description: https://datasheet.octopart.com:443/CRCW040230K9FKED.-Vishay-datasheet-78776209.pdf?src-supplier=Newark; ComponentLink8URL: https://datasheet.octopart.com:443/CRCW040230K9FKED-Vishay-datasheet-66077789.pdf?src-supplier=Newark; ComponentLink8Description: https://datasheet.octopart.com:443/CRCW040230K9FKED-Vishay-datasheet-66077789.pdf?src-supplier=Newark; ComponentLink9URL: https://datasheet.octopart.com:443/CRCW040230K9FKED-Vishay-datasheet-11761042.pdf?src-supplier=Newark; ComponentLink9Description: https://datasheet.octopart.com:443/CRCW040230K9FKED-Vishay-datasheet-11761042.pdf?src-supplier=Newark; ComponentLink10URL: https://datasheet.octopart.com:443/CRCW040230K9FKED-Vishay-datasheet-159614168.pdf?src-supplier=Newark; ComponentLink10Description: https://datasheet.octopart.com:443/CRCW040230K9FKED-Vishay-datasheet-159614168.pdf?src-supplier=Newark; ComponentLink11URL: https://datasheet.octopart.com:443/CRCW040230K9FKED-Vishay-datasheet-33013972.pdf?src-supplier=Newark; ComponentLink11Description: https://datasheet.octopart.com:443/CRCW040230K9FKED-Vishay-datasheet-33013972.pdf?src-supplier=Newark; ComponentLink12URL: https://datasheet.octopart.com:443/CRCW040230K9FKED-Vishay-datasheet-21268114.pdf?src-supplier=Newark; ComponentLink12Description: https://datasheet.octopart.com:443/CRCW040230K9FKED-Vishay-datasheet-21268114.pdf?src-supplier=Newark; ComponentLink13URL: https://datasheet.octopart.com:443/CRCW040230K9FKED-Vishay-datasheet-21226360.pdf?src-supplier=Newark; ComponentLink13Description: https://datasheet.octopart.com:443/CRCW040230K9FKED-Vishay-datasheet-21226360.pdf?src-supplier=Newark; ComponentLink14URL: https://datasheet.octopart.com:443/CRCW040230K9FKED-Vishay-datasheet-62316122.pdf?src-supplier=Future+Electronics; ComponentLink14Description: https://datasheet.octopart.com:443/CRCW040230K9FKED-Vishay-datasheet-62316122.pdf?src-supplier=Future+Electronics; ComponentLink15URL: https://datasheet.octopart.com:443/CRCW040230K9FKED-Vishay-datasheet-12509741.pdf?src-supplier=Future+Electronics; ComponentLink15Description: https://datasheet.octopart.com:443/CRCW040230K9FKED-Vishay-datasheet-12509741.pdf?src-supplier=Future+Electronics; ComponentLink16URL: https://datasheet.octopart.com:443/CRCW040230K9FKED-Vishay-Dale-datasheet-47688880.pdf?src-supplier=RS+(Formerly+Allied+Electronics); ComponentLink16Description: https://datasheet.octopart.com:443/CRCW040230K9FKED-Vishay-Dale-datasheet-47688880.pdf?src-supplier=RS+(Formerly+Allied+Electronics); ComponentLink17URL: https://datasheet.octopart.com:443/CRCW040230K9FKED-Vishay-datasheet-12001583.pdf?src-supplier=RS+(Formerly+Allied+Electronics); ComponentLink17Description: https://datasheet.octopart.com:443/CRCW040230K9FKED-Vishay-datasheet-12001583.pdf?src-supplier=RS+(Formerly+Allied+Electronics); ComponentLink18URL: https://datasheet.octopart.com/D-CRCW-e3-Standard-Thick-Film-Chip-Resistors-Vishay-datasheet-family-64.pdf; ComponentLink18Description: https://datasheet.octopart.com/D-CRCW-e3-Standard-Thick-Film-Chip-Resistors-Vishay-datasheet-family-64.pdf; ComponentLink19URL: https://datasheet.octopart.com:443/CRCW040230K9FKED-Vishay-datasheet-11516975.pdf?src-supplier=Farnell; ComponentLink19Description: https://datasheet.octopart.com:443/CRCW040230K9FKED-Vishay-datasheet-11516975.pdf?src-supplier=Farnell; ComponentLink20URL: https://datasheet.octopart.com:443/CRCW040230K9FKED-Vishay-datasheet-8445837.pdf?src-supplier=element14; ComponentLink20Description: https://datasheet.octopart.com:443/CRCW040230K9FKED-Vishay-datasheet-8445837.pdf?src-supplier=element14; ComponentLink21URL: https://datasheet.octopart.com:443/CRCW040230K9FKED-Vishay-datasheet-5377255.pdf?src-supplier=Garrett; ComponentLink21Description: https://datasheet.octopart.com:443/CRCW040230K9FKED-Vishay-datasheet-5377255.pdf?src-supplier=Garrett; ComponentLink22URL: https://datasheet.octopart.com:443/CRCW040230K9FKED-Vishay-datasheet-148188.pdf?src-supplier=Garrett; ComponentLink22Description: https://datasheet.octopart.com:443/CRCW040230K9FKED-Vishay-datasheet-148188.pdf?src-supplier=Garrett; ComponentLink23URL: https://datasheet.octopart.com:443/CRCW040230K9FKED-Vishay-datasheet-42367.pdf?src-supplier=Garrett; ComponentLink23Description: https://datasheet.octopart.com:443/CRCW040230K9FKED-Vishay-datasheet-42367.pdf?src-supplier=Garrett; ComponentLink24URL: http://sigma.octopart.com:80/rohs_certificate/D-CRCW-e3-Standard-Thick-Film-Chip-Resistors-Vishay-family-102.pdf?src-supplier=Compliance+Statements; ComponentLink24Description: http://sigma.octopart.com:80/rohs_certificate/D-CRCW-e3-Standard-Thick-Film-Chip-Resistors-Vishay-family-102.pdf?src-supplier=Compliance+Statements